# EAGLE design EXIST_1U_Pulplogic_PCB (EAGLE 9.1.3)
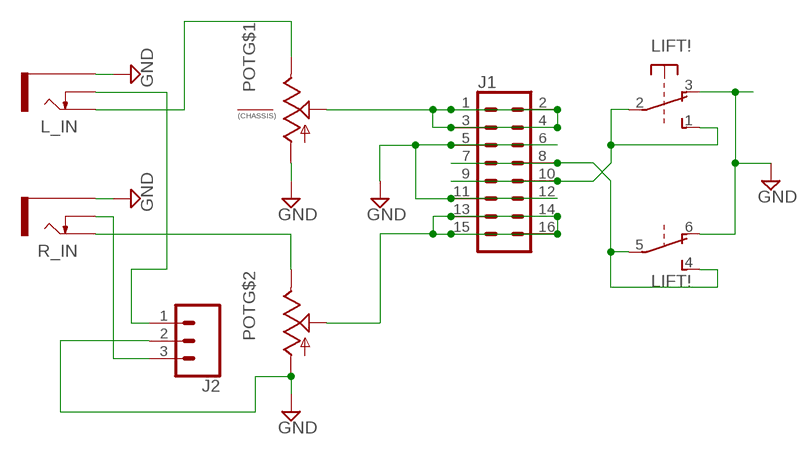
[diagram p0: schematic, sheet 1]

## Parts
J1  CONN_08X2  [2X8]
J2  CONN_03  [1X03]
L_IN  THONKICONNNEW  [WQP-PJ301M-12_JACK]
LIFT!  9450-2  [9450-2]
POT  ALPHA-9MM-DUALPOT  [DUAL_9MM_SNAP-IN_POT]
R_IN  THONKICONNNEW  [WQP-PJ301M-12_JACK]

## Nets
GND: J1.5 J1.6 J1.11 J1.12 J2.2 L_IN.P$3_SLEEVE(SLEEVE) LIFT!.3(1:O) LIFT!.6(2:O) POT.1(A) POT.1B(A) R_IN.P$3_SLEEVE(SLEEVE)
N$1: J1.13 J1.14 J1.15 J1.16 POT.2B(S)
N$2: J1.1 J1.2 J1.3 J1.4 POT.2(S)
N$4: J1.7 J1.8 LIFT!.4(2:S) LIFT!.5(2:P)
N$5: J2.1 L_IN.P$2_SWITCH(SWITCH)
N$6: POT.3B(E) R_IN.P$1_TIP(TIP)
N$7: L_IN.P$1_TIP(TIP) POT.3(E)
N$8: J2.3 R_IN.P$2_SWITCH(SWITCH)
N$10: J1.9 J1.10 LIFT!.1(1:S) LIFT!.2(1:P)
Unconnected: POT.CHASSIS1 POT.CHASSIS2

## Library data of the parts
J1 = SparkFun-Connectors:CONN_08X2: Multi connection point. Often used as Generic Header-pin footprint for 0.1 inch spaced/style header connections You can populate with any combo of single row headers, but if you'd like an exact match, check this: Header - 2x8 (Male, 0.1") <https://www.sparkfun.com/products/13156> (PRT-13156) On any of the 0.1 inch spaced packages, you can populate with these: Break Away Headers - Straight <https://www.sparkfun.com/products/116> (PRT-00116) Break Away Male Headers - Right Angle <https://www.sparkfun.com/products/553> (PRT-00553) Female Headers <https://www.sparkfun.com/products/115> (PRT-00115) Break Away Headers - Machine Pin <https://www.sparkfun.com/products/117> (PRT-00117) Break Away Female Headers - Swiss Machine Pin <https://www.sparkfun.com/products/743> (PRT-00743)
J2 = SparkFun-Connectors:CONN_03: Multi connection point. Often used as Generic Header-pin footprint for 0.1 inch spaced/style header connections On any of the 0.1 inch spaced packages, you can populate with these: Break Away Headers - Straight <https://www.sparkfun.com/products/116> (PRT-00116) Break Away Male Headers - Right Angle <https://www.sparkfun.com/products/553> (PRT-00553) Female Headers <https://www.sparkfun.com/products/115> (PRT-00115) Break Away Headers - Machine Pin <https://www.sparkfun.com/products/117> (PRT-00117) Break Away Female Headers - Swiss Machine Pin <https://www.sparkfun.com/products/743> (PRT-00743) Stackable Header - 3 Pin (Female, 0.1") <https://www.sparkfun.com/products/13875> (PRT-13875) For SCREWTERMINALS and SPRING TERMINALS visit here: Screw Terimnals on SparkFun.com <https://www.sparkfun.com/search/results?term=Screw+Terminals> (5mm/3.5mm/2.54mm spacing) This device is also useful as a general connection point to wire up your design to another part of your project. Our various solder wires solder well into these plated through hole pads. Hook-Up Wire - Assortment (Stranded, 22 AWG) <https://www.sparkfun.com/products/11375> (PRT-11375) Hook-Up Wire - Assortment (Solid Core, 22 AWG) <https://www.sparkfun.com/products/11367> (PRT-11367) View the entire wire category on our website here <https://www.sparkfun.com/categories/141> Special notes: Molex polarized connector foot print use with SKU : PRT-08232 with associated crimp pins and housings.
L_IN R_IN = MusicThingModular:THONKICONN: 3.5mm socket for Eurorack modular synths
LIFT! = switch-misc:9450-2: MARQUARDT SWITCH
POT = MusicThingModular:ALPHA-9MM-DUALPOT: 9mm vertical snap-in pot, Alpha / Panasonic style, with a connection to the metal chassis for grounding

## Board
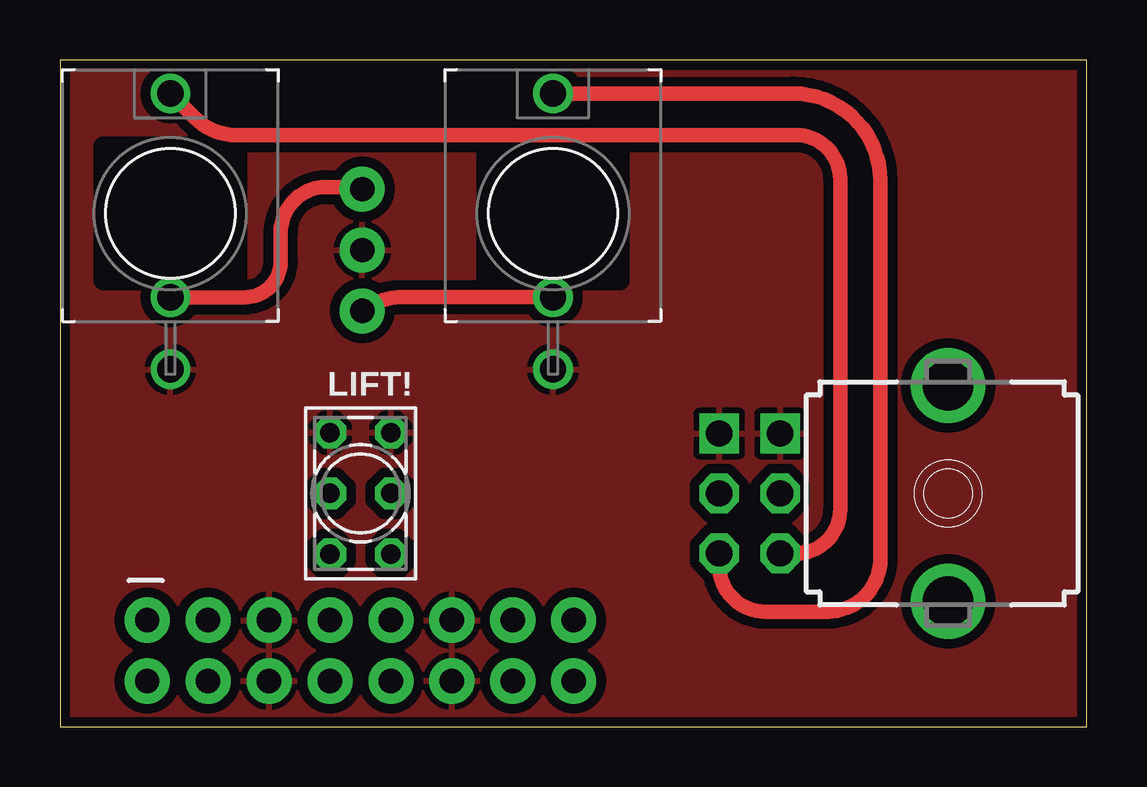
[diagram p1: board, top side]
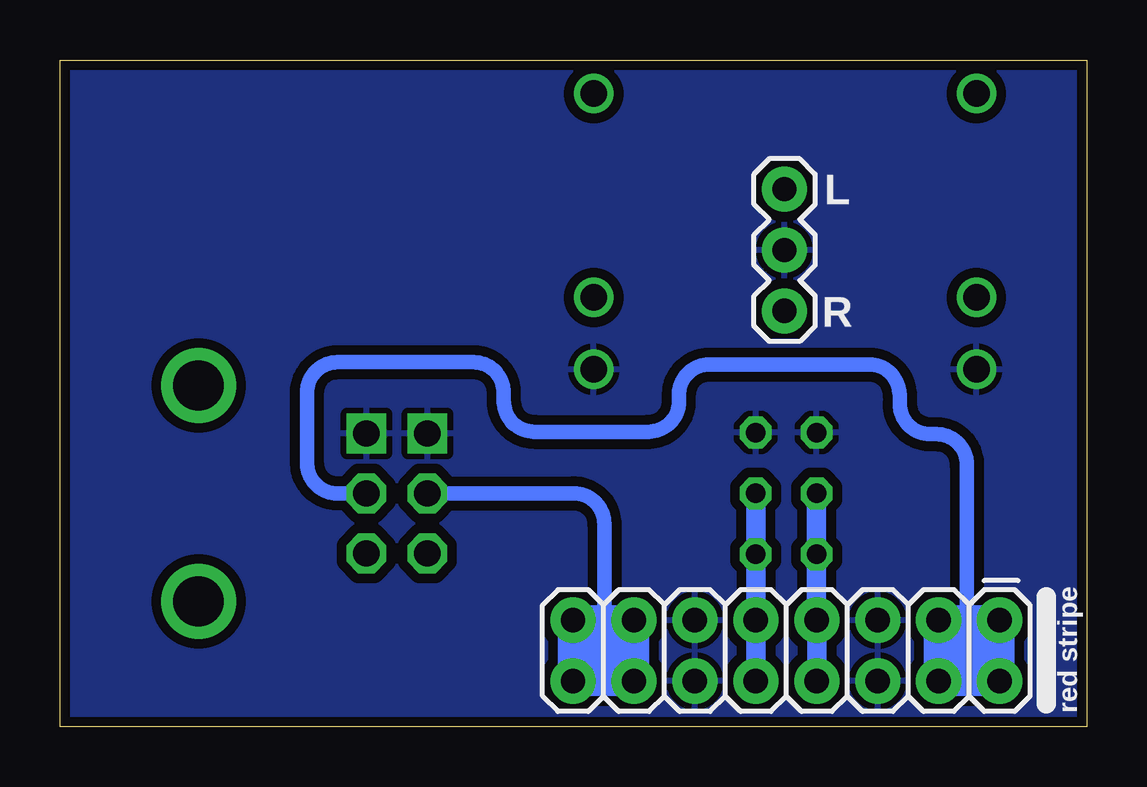
[diagram p2: board, bottom side, seen from below]

Size 42.8 x 27.8 mm. Coordinates in mm from the lower left corner, seen from the top.
Outline: 0,0 42.8,0 42.8,27.8 0,27.8 0,0
Copper layers (1*16): Top 0.035mm / dielectric 1.5mm / Bottom 0.035mm
Design rules "default *": minimum track width 6mil, minimum drill 0.35mm, track to track 6mil, track to pad 6mil, pad to pad 6mil, via to via 6mil, smd to smd 6mil, copper to edge 10mil, drill to drill 6mil, minimum pad ring 10mil, minimum via ring 8mil, stop-mask expansion 4mil, vias tented up to drill 0mil, thermal gap 10mil

### Footprints (pad centres in the part's own frame; a part is rotated, then mirrored left to right if it is on the bottom)
2X8 = drill 1.016 pad 1.88: 1 0,0; 2 0,2.54; 3 2.54,0; 4 2.54,2.54; 5 5.08,0; 6 5.08,2.54; 7 7.62,0; 8 7.62,2.54; 9 10.16,0; 10 10.16,2.54; 11 12.7,0; 12 12.7,2.54; 13 15.24,0; 14 15.24,2.54; 15 17.78,0; 16 17.78,2.54
1X03 = drill 1.016 pad 1.88: 1 0,0; 2 2.54,0; 3 5.08,0
WQP-PJ301M-12_JACK = drill 1.1: P$1_TIP 0,5; P$2_SWITCH 0,-3.5; P$3_SLEEVE 0,-6.5
9450-2 = drill 0.813 octagon: 1 -2.54,-1.27; 2 0,-1.27; 3 2.54,-1.27; 4 -2.54,1.27; 5 0,1.27; 6 2.54,1.27
DUAL_9MM_SNAP-IN_POT = drill 1.1 square: 1 -2.5,-7; 1B -2.5,-9.54 | drill 1.1 octagon: 2 0,-7; 2B 0,-9.54; 3 2.5,-7; 3B 2.5,-9.54 | drill 2.1 pad 2.54: CHASSIS1 -4.5,0; CHASSIS2 4.5,0

### Placement (x,y rotation side)
J1  3.63,4.45 180 bottom
J2  12.6,22.41 270 bottom
L_IN  4.6,21.4 0 top
LIFT!  12.53,9.73 90 top
POT  37.02,9.73 270 top
R_IN  20.55,21.4 0 top

### Tracks (layer width: path | path; a pad name or v marks a point on that pad's centre or on a via)
GND
  pour Bottom (isolate 0.406): 0,-0.2 0,27.86 42.7,27.86 42.7,-0.2
  pour Top (isolate 0.406): -0.04,-0.3 -0.04,27.82 42.73,27.82 42.73,-0.3
N$1
  Bottom 0.61: POT.2B 21.38,9.73 arc90 20.11,8.46 20.11,3.21
  Bottom 1.27: J1.13 J1.15 | J1.15 J1.16 | J1.16 J1.14 | J1.14 J1.13 | J1.13 20.11,3.21 J1.16 | J1.15 J1.14
N$2
  Bottom 0.61: POT.2 31.23,9.73 arc90 32.5,11 32.5,13.93 arc90 31.23,15.2 25.57,15.2 arc90 24.3,13.93 24.3,13.57 arc-90 23.03,12.3 18.27,12.3 arc-90 17,13.57 17,13.83 arc90 15.73,15.1 9.07,15.1 arc90 7.8,13.83 7.8,13.47 arc-90 6.53,12.2 6.27,12.2 arc90 5,10.93 5,3.24 4.84,3.24
  Bottom 1.27: J1.4 J1.2 | J1.2 J1.1 | J1.1 J1.3 | J1.3 J1.4 | J1.1 4.84,3.24 J1.4 | J1.3 J1.2
N$4
  Bottom 0.813: LIFT!.5 LIFT!.4 J1.7 arc-90 J1.7 J1.8
N$5
  Top 0.61: L_IN.P$2_SWITCH 7.7,17.9 arc90 9.2,19.4 9.2,20.6 arc-90 11.1,22.5 12.51,22.5 arc-90 J2.1
N$6
  Top 0.61: R_IN.P$1_TIP 30.56,26.4 arc-90 34.2,22.76 34.2,7 arc-90 32,4.8 29.4,4.8 arc-90 27.48,6.72 POT.3B
N$7
  Top 0.61: POT.3 30.68,7.23 arc90 32.52,9.07 32.52,22.82 arc90 30.68,24.66 7.39,24.66 arc-45 5.59,25.41 L_IN.P$1_TIP
N$8
  Top 0.61: R_IN.P$2_SWITCH arc90 R_IN.P$2_SWITCH 14.13,17.91 arc45 12.75,17.33 J2.3
N$10
  Bottom 0.813: LIFT!.2 LIFT!.1 J1.9 arc-90 J1.9 J1.10

### Text on the board
bNames: L | R | red stripe